# Altium schematic sheet GateAmp.SchDoc
size 558 x 431 mm; SheetNumber: 1; SheetTotal: 1; ENG_APP_DATE: --/--/--; DSN_APP_DATE: --/--/--; CHK_APP_DATE: --/--/--
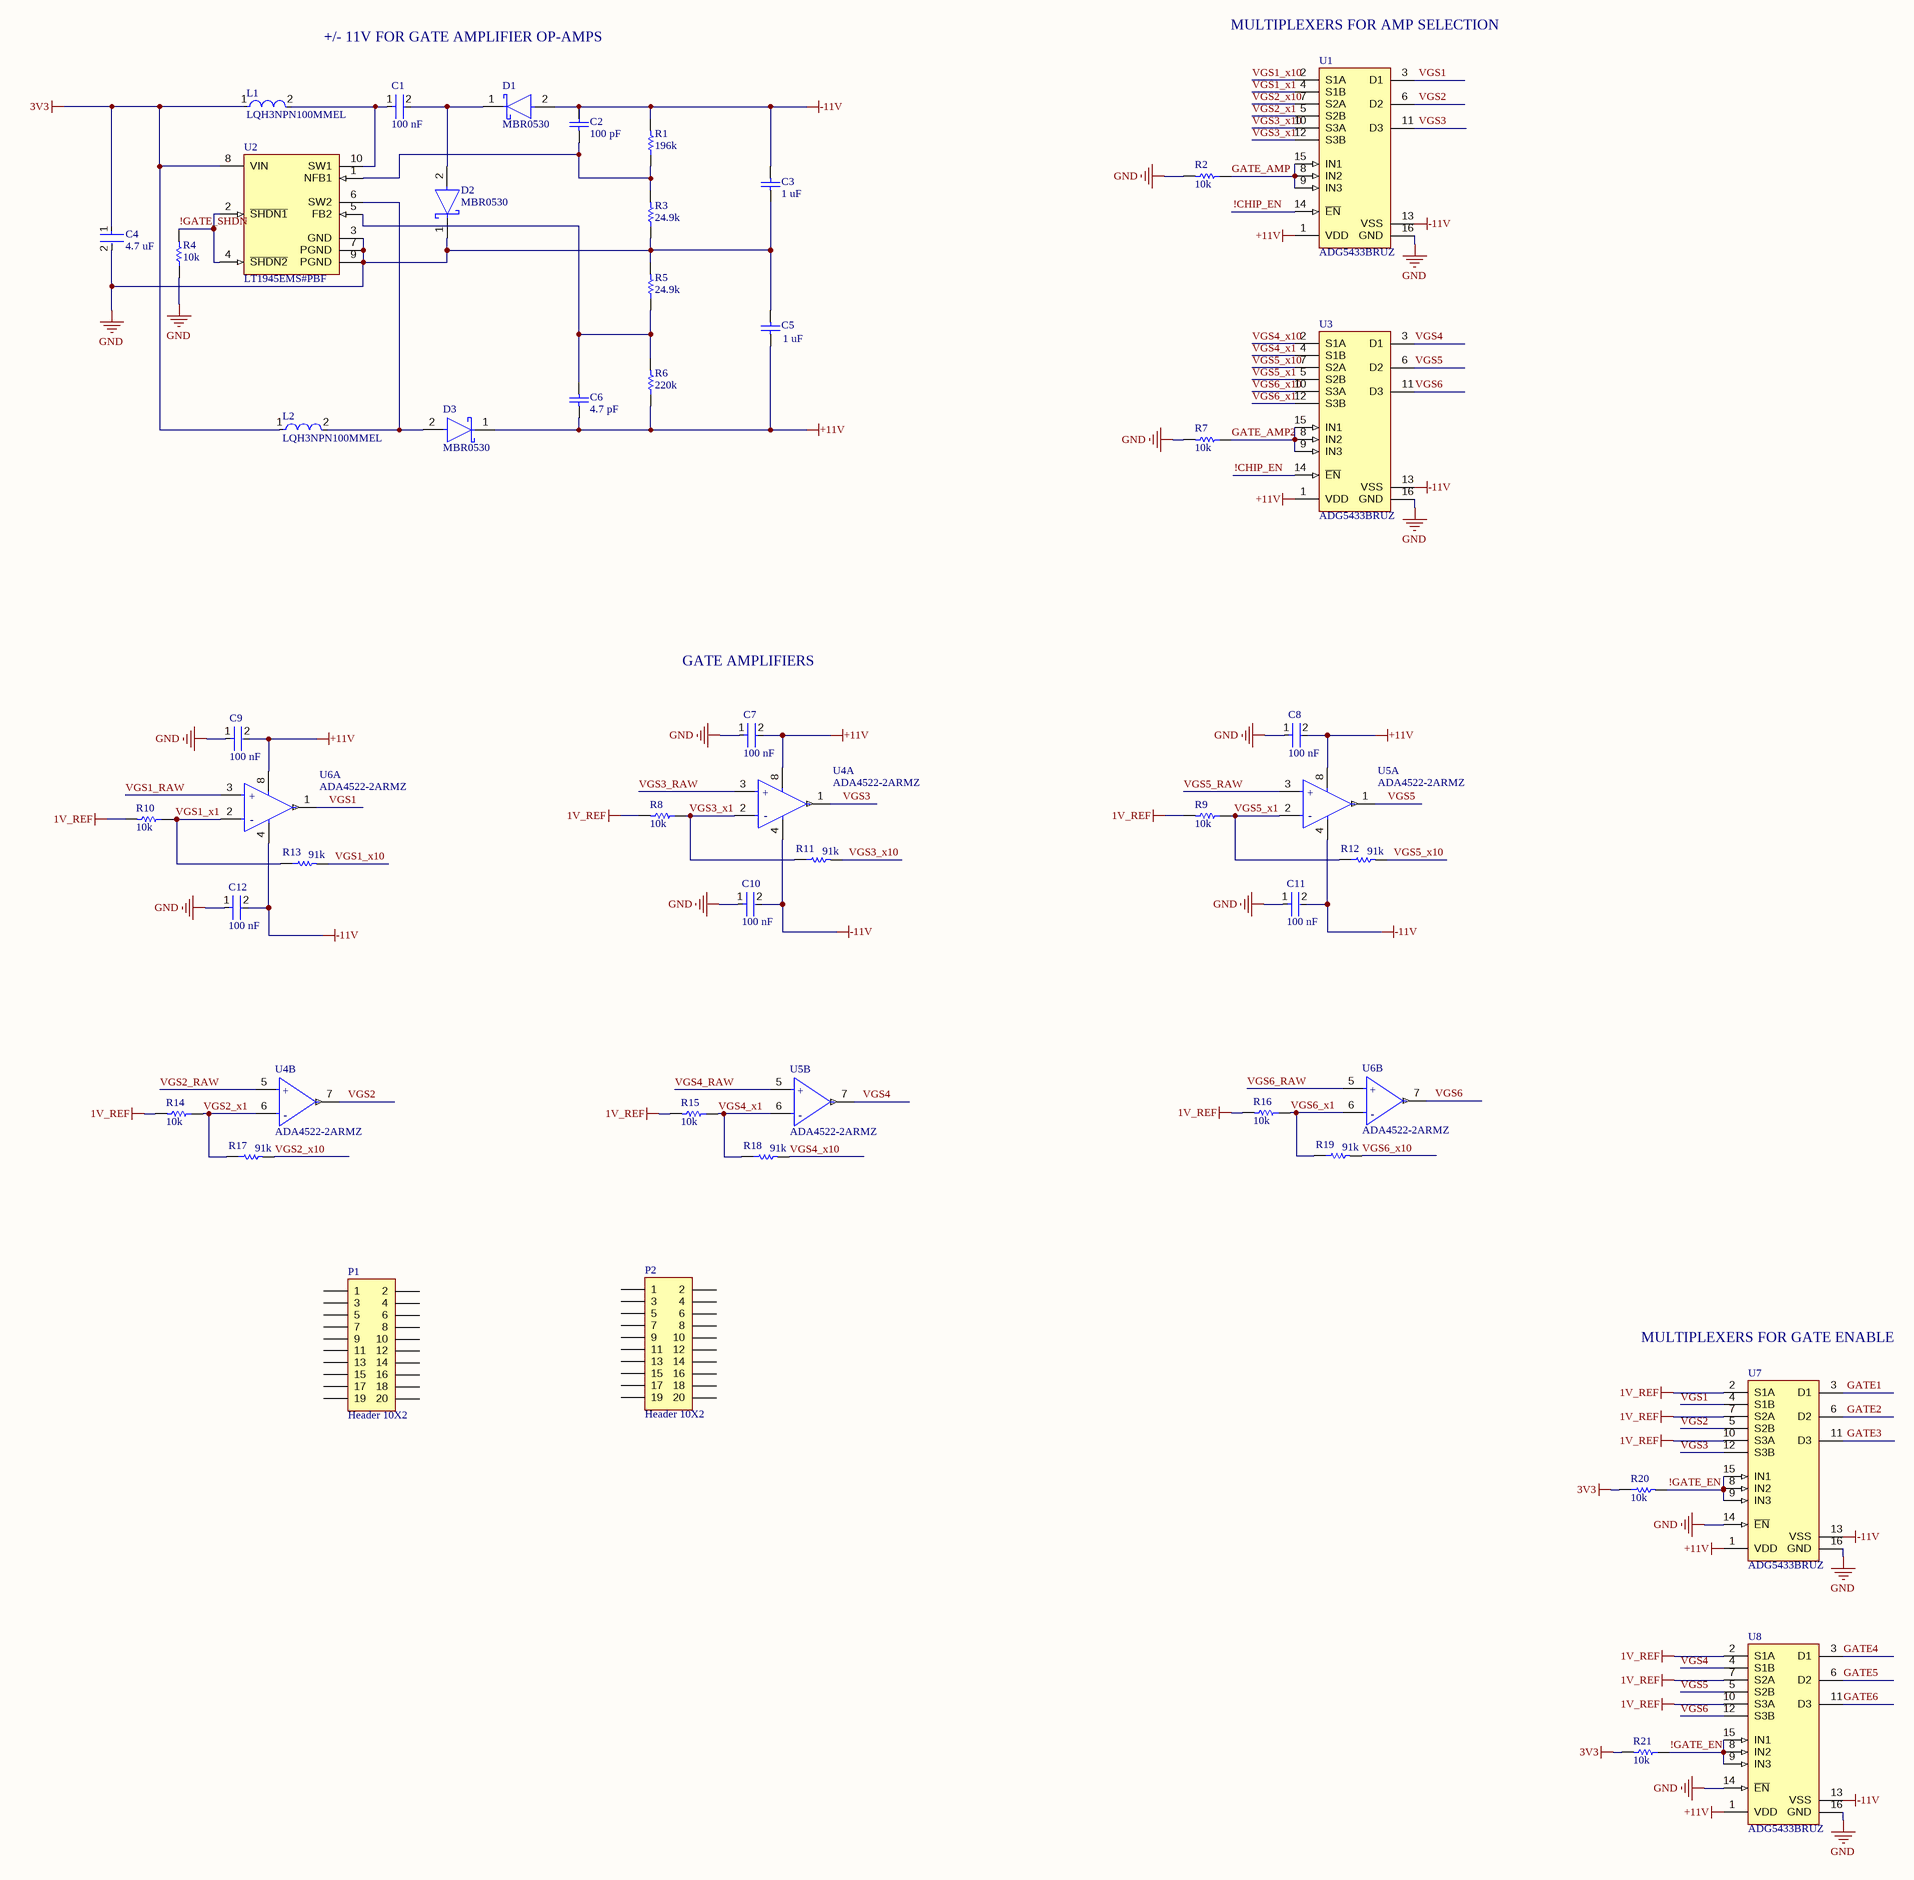
[diagram p0: GateAmp.SchDoc]

## Parts
C1  100 nF  [FP-C0805C-DN-MFG]
C2  100 pF  [CAPC2013X140X50ML20T25]
C3  1 uF  [CAPC3216X110X50LL20T25]
C4  4.7 uF  [FP-C0805C475K3PACTU-MFG]
C5  1 uF  [CAPC3216X110X50LL20T25]
C6  4.7 pF  [CAPC2013X71X50ML20T25]
C7  100 nF  [FP-C0805C-DN-MFG]
C8  100 nF  [FP-C0805C-DN-MFG]
C9  100 nF  [FP-C0805C-DN-MFG]
C10  100 nF  [FP-C0805C-DN-MFG]
C11  100 nF  [FP-C0805C-DN-MFG]
C12  100 nF  [FP-C0805C-DN-MFG]
D1  MBR0530  [FP-425-04-MFG]
D2  MBR0530  [FP-425-04-MFG]
D3  MBR0530  [FP-425-04-MFG]
L1  LQH3NPN100MMEL  [FP-LQH3NPH_ME-MFG]
L2  LQH3NPN100MMEL  [FP-LQH3NPH_ME-MFG]
P1  Header 10X2  [HDR2X10]
P2  Header 10X2  [HDR2X10]
R1  196k  [RESC2013X50X30LL20T20]
R2  10k  [RESC2013X60X35NL10T20]
R3  24.9k  [RESC2013X70X40LL20T20]
R4  10k  [RESC2013X60X35NL10T20]
R5  24.9k  [RESC2013X70X40LL20T20]
R6  220k  [RESC2013X70X40ML20T20]
R7  10k  [RESC2013X60X35NL10T20]
R8  10k  [RESC2013X60X35NL10T20]
R9  10k  [RESC2013X60X35NL10T20]
R10  10k  [RESC2013X60X35NL10T20]
R11  91k  [RESC2013X60X40LL20T25]
R12  91k  [RESC2013X60X40LL20T25]
R13  91k  [RESC2013X60X40LL20T25]
R14  10k  [RESC2013X60X35NL10T20]
R15  10k  [RESC2013X60X35NL10T20]
R16  10k  [RESC2013X60X35NL10T20]
R17  91k  [RESC2013X60X40LL20T25]
R18  91k  [RESC2013X60X40LL20T25]
R19  91k  [RESC2013X60X40LL20T25]
R20  10k  [RESC2013X60X35NL10T20]
R21  10k  [RESC2013X60X35NL10T20]
U1  ADG5433BRUZ  [ADI-RU-16_N]
U2  LT1945EMS#PBF  [LT-MS-10_N]
U3  ADG5433BRUZ  [ADI-RU-16_N]
U4  ADA4522-2ARMZ  [FP-RM-8-IPC_C]  (parts A,B of 2)
U5  ADA4522-2ARMZ  [FP-RM-8-IPC_C]  (parts A,B of 2)
U6  ADA4522-2ARMZ  [FP-RM-8-IPC_C]  (parts A,B of 2)
U7  ADG5433BRUZ  [ADI-RU-16_N]
U8  ADG5433BRUZ  [ADI-RU-16_N]

## Nets
1V_REF: R8.2 R9.2 R10.2 R14.2 R15.2 R16.2 U7.2(S1A) U7.7(S2A) U7.10(S3A) U8.2(S1A) U8.7(S2A) U8.10(S3A)
3V3: C4.1 L1.1 L2.1 R20.1 R21.2 U2.8(VIN)
+11V: C5.1 C6.1 C7.2 C8.2 C9.2 D3.1(C) R6.1 U1.1(VDD) U3.1(VDD) U4.8(V+) U5.8(V+) U6.8(V+) U7.1(VDD) U8.1(VDD)
-11V: C2.1 C3.2 C10.2 C11.2 C12.2 D1.2(A) R1.2 U1.13(VSS) U3.13(VSS) U4.4(V-) U5.4(V-) U6.4(V-) U7.13(VSS) U8.13(VSS)
GND: C3.1 C4.2 C5.2 C7.1 C8.1 C9.1 C10.1 C11.1 C12.1 D2.1(C) R2.2 R3.1 R4.1 R5.2 R7.2 U1.16(GND) U2.3(GND) U2.7(PGND) U2.9(PGND) U3.16(GND) U7.14(~{EN}) U7.16(GND) U8.14(~{EN}) U8.16(GND)
!CHIP_EN: U1.14(~{EN}) U3.14(~{EN})
!GATE_EN: R20.2 R21.1 U7.8(IN2) U7.9(IN3) U7.15(IN1) U8.8(IN2) U8.9(IN3) U8.15(IN1)
!GATE_SHDN: R4.2 U2.2(~{SHDN1}) U2.4(~{SHDN2})
GATE1: U7.3(D1)
GATE2: U7.6(D2)
GATE3: U7.11(D3)
GATE4: U8.3(D1)
GATE5: U8.6(D2)
GATE6: U8.11(D3)
GATE_AMP: R2.1 U1.8(IN2) U1.9(IN3) U1.15(IN1)
GATE_AMP2: R7.1 U3.8(IN2) U3.9(IN3) U3.15(IN1)
VGS1: U1.3(D1) U6.1(OUT_A) U7.4(S1B)
VGS1_RAW: U6.3(+IN_A)
VGS1_x1: R10.1 R13.1 U1.4(S1B) U6.2(-IN_A)
VGS1_x10: R13.2 U1.2(S1A)
VGS2: U1.6(D2) U4.7(OUT_B) U7.5(S2B)
VGS2_RAW: U4.5(+IN_B)
VGS2_x1: R14.1 R17.1 U1.5(S2B) U4.6(-IN_B)
VGS2_x10: R17.2 U1.7(S2A)
VGS3: U1.11(D3) U4.1(OUT_A) U7.12(S3B)
VGS3_RAW: U4.3(+IN_A)
VGS3_x1: R8.1 R11.1 U1.12(S3B) U4.2(-IN_A)
VGS3_x10: R11.2 U1.10(S3A)
VGS4: U3.3(D1) U5.7(OUT_B) U8.4(S1B)
VGS4_RAW: U5.5(+IN_B)
VGS4_x1: R15.1 R18.1 U3.4(S1B) U5.6(-IN_B)
VGS4_x10: R18.2 U3.2(S1A)
VGS5: U3.6(D2) U5.1(OUT_A) U8.5(S2B)
VGS5_RAW: U5.3(+IN_A)
VGS5_x1: R9.1 R12.1 U3.5(S2B) U5.2(-IN_A)
VGS5_x10: R12.2 U3.7(S2A)
VGS6: U3.11(D3) U6.7(OUT_B) U8.12(S3B)
VGS6_RAW: U6.5(+IN_B)
VGS6_x1: R16.1 R19.1 U3.12(S3B) U6.6(-IN_B)
VGS6_x10: R19.2 U3.10(S3A)
NetC1_1: C1.1 L1.2 U2.10(SW1)
NetC1_2: C1.2 D1.1(C) D2.2(A)
NetC2_2: C2.2 R1.1 R3.2 U2.1(NFB1)
NetC6_2: C6.2 R5.1 R6.2 U2.5(FB2)
NetD3_2: D3.2(A) L2.2 U2.6(SW2)

Not connected (* = marked no-connect by the designer): P1 1 2 3 4 5 6 7 8 9 10 11 12 13 14 15 16 17 18 19 20; P2 1 2 3 4 5 6 7 8 9 10 11 12 13 14 15 16 17 18 19 20

## Notes on the sheet
- +/- 11V FOR GATE AMPLIFIER OP-AMPS
- (near U1) MULTIPLEXERS FOR AMP SELECTION
- GATE AMPLIFIERS
- (near U7) MULTIPLEXERS FOR GATE ENABLE
- DWG. NO.
- REV.
- SHT.
- REVISION
- DESCRIPTION
- DATE
- APPROVED
- THIS DOCUMENT AND THE DATA DISCLOSED HEREIN OR HEREWITH IS THE PROPERTY OF ALTIUM LIMITED AND MAY BE FREELY DISTRIBUTED IN WHOLE. NO RIGHTS ARE RESERVED OR EXPRESS OR IMPLIED WARANTEE GIVEN.
- ENG:
- DSN:
- APPROVALS
- PROJECT
- DOCUMENT REVISION:
- DESIGN ITEM:
- CHK:
- BOM:
- REFERENCE DOCUMENTS
- PROJECT REVISION:
- TITLE
- FAB DWG:
- PCB DWG:
- ASSY DWG:
- SCALE:
- SIZE
- C
- CAGE CODE
- FILE NAME
- DWG NO.
- SHEET
- OF
- REV
- (in symbol CMP-09116-000003-2, part A) +; -
- (in symbol CMP-09116-000003-2, part B) +; -

## Library data of the parts
C1 C7-C12 = CMP-2007-00279-2: CAP CER 0.1UF 50V X7R 0805; Manufacturer Part Number: C0805C104K5RACTU; Manufacturer: KEMET; Value: 0.10 μF; Tolerance: 0.1; Temperature Coefficient: 30ppm/°C; Material: Ceramic; Device Class L2: Capacitors; Temperature Range Low: -55°C; Voltage Rating: 50 V; Digikey Description: CAP CER 0.1UF 50V X7R 0805; Category: Cap; ComponentLink2Description: Datasheet; Octopart: https://octopart.com/c0805c104k5ractu-kemet-143926; RoHS: TRUE; ComponentLink2URL: https://content.kemet.com/datasheets/KEM_C1003_C0G_SMD.pdf; Temperature Characteristic: X7R; Temperature: -55°C to +125°C; Height: 0.88mm; Temperature Range High: +125°C; Device Class L1: Passive Components; Automotive: No; Lead Free: Yes; Ipc Land Pattern Name: CAPC200125X78; Device Class L3: Ceramic Capacitors; Mouser Description: Cap Ceramic 0.1uF 50V X7R 10% SMD 2.0 x 1.2 mm 125 C Paper T/R; Capacitance: 0.10 μF; Package: C0805C-DN
C2 = CMP-2007-04713-1: 08055C101KAT2A; Manufacturer: AVX Interconnect / Elco; Part Number: 08055C101KAT2A
C3 C5 = CMP-2000-06011-1: C1206C105K5RACTU; Manufacturer: Kemet; Case Height: 1mm; Dielectric: X7R; Voltage Rating: 50V; Capacitance: 1uF; Temperature Coefficient / Code: +/-15%; Case Length: 3.2mm; Case Width: 1.6mm; Type: SMDMLCCX7R6.3-250VDCCommericalGrade; Tolerance: 10%; Class: Class1; Capacitance - nF: 1000nF; Datasheet URL: http://www.kemet.com/docfinder?Partnumber=C1206C105K5RACTU; Product Category: MultilayerCeramicCapacitorsMLCC-SMD/SMT; Termination Style: SMD/SMT; Dimensions: 1.6mmWx3.2mmLx1mmH; Voltage Rating DC: 50V; Datasheet Version: 02/2016; Packaging: Reel; Brand: Kemet; RoHS: Details; Minimum Operating Temperature: -55C; Operating Temperature Range: -55Cto+125C; Package Reference: 1206; Manufacturer URL: http://www.kemet.com/; Product: GeneralTypeMLCCs; Package Description: 2-Pin Surface Mount Device, Body 3.2 x 1.6 mm; Mounting Technology: SurfaceMount; Case Code - mm: 3216; Maximum Operating Temperature: +125C; Series: C1206C; Factory Pack Quantity: 2500; Package / Case: 1206(3216metric); Case Code - in: 1206
C4 = CMP-2007-01010-2: CAP CER 4.7UF 25V X5R 0805; Tolerance: 10%; Dielectric Material: Ceramic; Dissipation Factor: 5%; Length: 2mm; Number of Pins: 2; Voltage Rating (DC): 25V; Depth: 1.25mm; Min Operating Temperature: -55°C; Capacitance: 4.7uF; Series: C0805C; Lead Free: Lead Free; Dielectric: X5R; REACH SVHC: No SVHC; Termination: SMD/SMT; Mount: PCB; Package Quantity: 2500; Contact Plating: Tin; Case Code (Imperial): 0805; Max Operating Temperature: 85°C; Width: 1.2mm; Voltage: 25V; Case/Package: 0805; Packaging: Tape and Reel; Height: 1.25mm; RoHS Compliant: Yes; Construction: Flat; Case Code (Metric): 2012; Radiation Hardening: No
C6 = CMP-1036-00549-2: 08055A4R7CAT2A; Manufacturer: AVX Interconnect / Elco; Part Number: 08055A4R7CAT2A
D1-D3 = CMP-2000-05113-2: DIODE SCHOTTKY 30V 500MA SOD123; Polarity: Standard; Max Reverse Leakage Current: 130uA; Forward Voltage: 430mV; Element Configuration: Single; Peak Non-Repetitive Surge Current: 5.5A; REACH SVHC: No SVHC; Contact Plating: Tin; Width: 1.6mm; Weight: 0.03g; Max Reverse Voltage (DC): 30V; Mount: Surface Mount; Max Repetitive Reverse Voltage (Vrrm): 30V; Number of Pins: 2; Height: 1.03mm; Current Rating: 500mA; Max Forward Surge Current (Ifsm): 5.5A; Lead Free: Lead Free; Max Surge Current: 5.5A; Peak Reverse Current: 130uA; Min Operating Temperature: -65°C; Radiation Hardening: No; Max Operating Temperature: 150°C; Average Rectified Current: 500mA; Packaging: Tape and Reel; Length: 2.7mm; Forward Current: 500mA; Voltage Rating (DC): 30V; Package Quantity: 1; Output Current: 500mA
L1 L2 = CMP-06042-002074-1: Wire Wound Ferrite Inductor for Power Lines 10μH ±20% 0.228Ω 1280mA 1212; Current Rating: 1.28A; DC Resistance (DCR): 228mR; Inductance: 10uH; Saturation Current: 810mA; Self Resonant Frequency: 20MHz; Shielding: Shielded; Test Frequency: 1MHz; Core Material: Ferrite; Resistor Type: Wirewound; Case/Package: 1212; Min Operating Temperature: -40°C; Packaging: Tape and Reel; Max Operating Temperature: 85°C; Tolerance: 20%; Case Code (Imperial): 1212; Case Code (Metric): 3030; Mount: Surface Mount
P1 P2 = Header 10X2: Header, 10-Pin, Dual row; LatestRevisionDate: 17-Jul-2002; LatestRevisionNote: Re-released for DXP Platform.; Publisher: Altium Limited
R1 = CMP-2001-04310-1: Manufacturer: Vishay Dale; Part Number: CRCW0805196KFKEA
R2 R4 R7-R10 R14-R16 R20 R21 = CMP-1659-00013-4: Chip Resistor, 10 KOhm, +/- 1%, 0.125 W, -55 to 155 degC, 0805 (2012 Metric), RoHS, Tape and Reel; Manufacturer: Yageo; Voltage Rating: 150 V; Mount: Surface Mount; ComponentLink1Description: Manufacturer URL; ComponentLink2URL: http://www.yageo.com/documents/recent/PYu-RC_Group_51_RoHS_L_04.pdf; Pins: 2; Length: 2 mm; Min Operating Temperature: -55 degC; Height: 0.5 mm; Mounting Technology: Surface Mount; RoHSCompliant: true; REACH SVHC: No SVHC; ComponentLink1URL: http://www.yageo.com/; Max Operating Temperature: 155 degC; PackageReference: 0805; DatasheetVersion: Rev. 4, 02/2016; Package Quantity: 5000; Packaging: Tape and Reel; ComponentLink2Description: Datasheet; PackageDescription: 2-Pin Surface Mounted Device, Body 2 x 1.25 mm
R3 R5 = CMP-2001-00073-1: Part Number: ERJ-6ENF2492V; Manufacturer: Panasonic
R6 = CMP-2001-00522-1: Part Number: ERJ6ENF2203V; Manufacturer: Panasonic
R11-R13 R17-R19 = CMP-2001-00677-1: Part Number: ERA6AEB913V; Manufacturer: Panasonic
U1 U3 U7 U8 = CMP-0794-00021-1: High Voltage Latch-Up Proof, Triple SPDT Switches, 12.5 Ohm Ron, 16-pin SOP (RU-16), Tube; Manufacturer: Analog Devices; Ron (ohms): 13.5, 12.5, 26, 14.5; Max Pos Supply: +40V; Max Neg Supply: -22V; # Sw Functions: 3; t ON: 160ns, 152ns, 228ns, 176ns; ComponentLink1URL: http://www.analog.com/en/index.html; Code_JEDEC: MO-153AB; PackageReference: RU-16; DatasheetVersion: Rev. B; PackageDescription: 16-Pin Thin Shrink Small Outline Package, Body 5 x 4.4 mm, Pitch 0.65 mm; PartNumber: ADG5433BRUZ; ComponentLink2Description: Datasheet; ComponentLink2URL: http://www.analog.com/static/imported-files/data_sheets/ADG5433_5434.pdf; Mounting Technology: Surface Mount; ComponentLink3URL: http:/www.analog.com/static/imported-files/packages/36244347913743854010197452789RU16.pdf; ComponentLink1Description: Manufacturer URL; ComponentLink3Description: Package Specification; Configuration: SPDT; Packing: Tube; PackageVersion: Nov-02
U2 = CMP-0478-00153-1: Dual Micropower DC/DC Converter with Positive and Negative Outputs, 1.2 to 15 V Vin, 10-pin SOP (MS-10), -40 to 85 degC, Pb-Free; Manufacturer: Linear Technology; Number of Outputs: 2; Vin Max(V): 15; Vin Min(V): 1.2; ComponentLink3Description: Package Specification; RoHS: TRUE; ComponentLink1Description: Manufacturer URL; ComponentLink2URL: http://cds.linear.com/docs/en/datasheet/1945fa.pdf; PartNumber: LT1945EMS#PBF; Mounting Technology: Surface Mount; PackageVersion: Rev. E, 06/2010; ComponentLink1URL: http://www.linear.com/; DatasheetVersion: Rev. A; PackageReference: MS-10; ComponentLink2Description: Datasheet; PackageDescription: 10-Pin Plastic MSOP, Body 3 x 3 mm, Pitch 0.5 mm; ComponentLink3URL: http://cds.linear.com/docs/en/packaging/05081661_F_MS.pdf
U4-U6 = CMP-09116-000003-2: IC OPAMP ZERO-DRIFT 2 CIRC 8MSOP; Max Dual Supply Voltage: 27.5V; Power Supply Rejection Ratio (PSRR): 150dB; Operating Supply Current: 830uA; Max Supply Voltage: 55V; Min Dual Supply Voltage: 2.25V; Input Bias Current: 50pA; Gain Bandwidth Product: 2.7MHz; Voltage Gain: 137dB; Common Mode Rejection Ratio: 140dB; Slew Rate: 1.7V/µs; Input Offset Voltage (Vos): 1.5uV; Output Current per Channel: 32mA; Min Supply Voltage: 4.5V; Packaging: Rail/Tube; Max Operating Temperature: 125°C; Min Operating Temperature: -40°C; Mount: Surface Mount; Number of Pins: 8; Case/Package: MSOP; Lead Free: Contains Lead